# EAGLE design untitled (EAGLE 7.5.0)
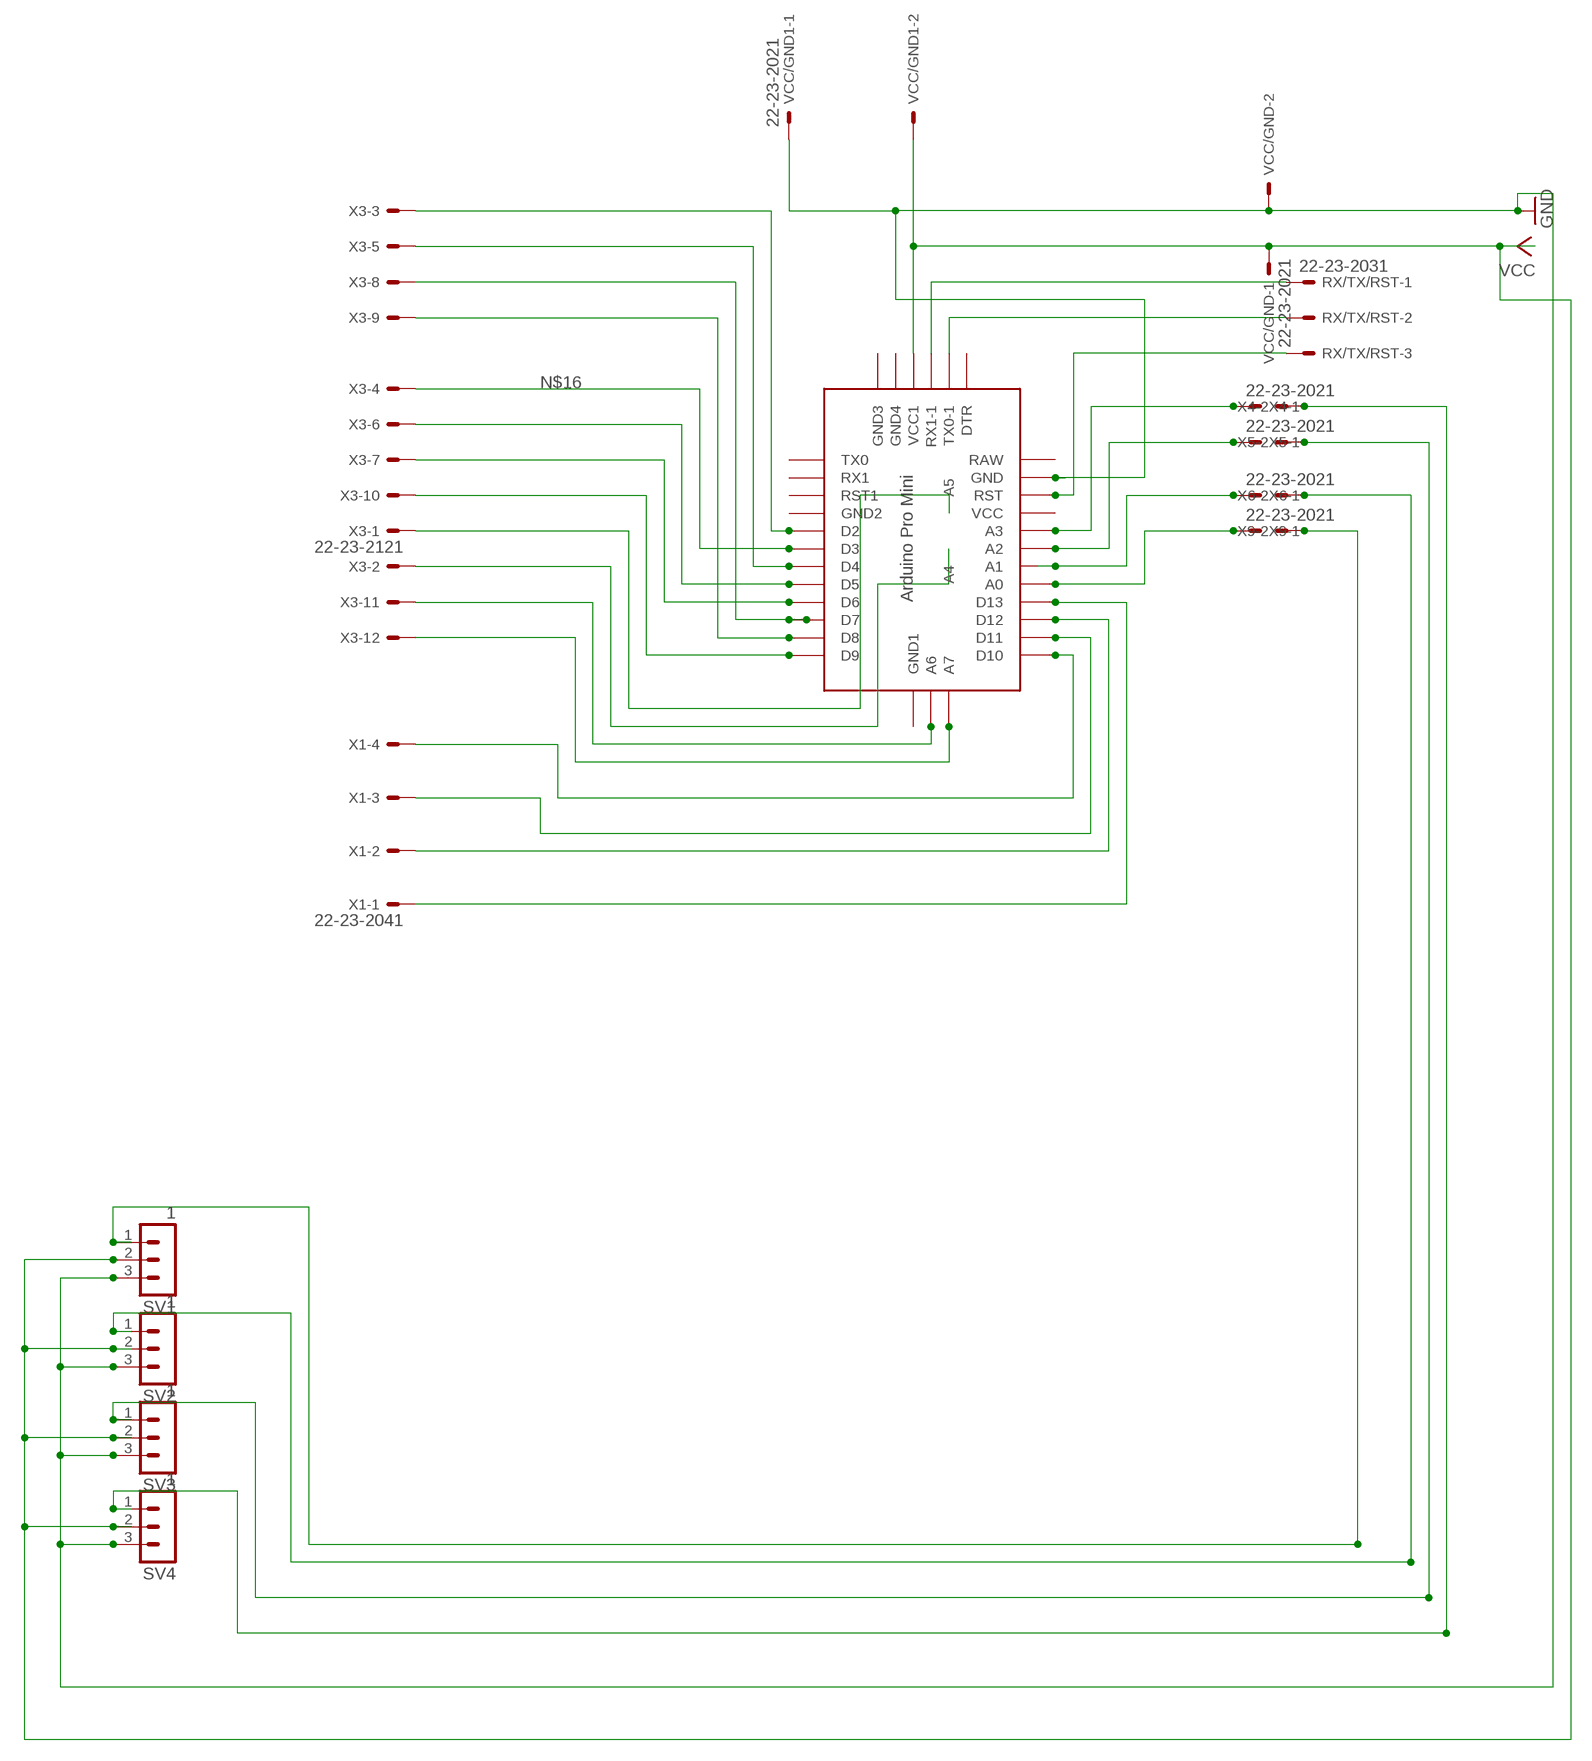
[diagram p0: schematic, sheet 1]

## Parts
RX/TX/RST  22-23-2031  [22-23-2031]
SV1  1  MA03-1  [MA03-1]
SV2  1  MA03-1  [MA03-1]
SV3  1  MA03-1  [MA03-1]
SV4  1  MA03-1  [MA03-1]
U$1  ABK-PRO-MINI  [ABK-PRO-MINI]
VCC/GND  22-23-2021  [22-23-2021]
VCC/GND1  22-23-2021  [22-23-2021]
X1  22-23-2041  [22-23-2041]
X3  22-23-2121  [22-23-2121]
X4  22-23-2021  [22-23-2021]
X5  22-23-2021  [22-23-2021]
X6  22-23-2021  [22-23-2021]
X9  22-23-2021  [22-23-2021]

## Nets
GND: SV1.3 SV2.3 SV3.3 SV4.3 U$1.GND VCC/GND1.1 VCC/GND.2
N$1: RX/TX/RST.2 U$1.TX0-1
N$2: U$1.A3 X4.1
N$3: U$1.D10 X1.4
N$4: U$1.A2 X5.1
N$5: RX/TX/RST.3 U$1.RST
N$6: SV4.1 X4.2
N$7: SV3.1 X5.2
N$8: SV2.1 X6.2
N$9: SV1.1 X9.2
N$10: U$1.D4 X3.5
N$11: U$1.D7 X3.8
N$12: U$1.D8 X3.9
N$13: U$1.D2 X3.3
N$14: U$1.D3 X3.4
N$15: U$1.D5 X3.6
N$16: U$1.D6 X3.7
N$17: U$1.D9 X3.10
N$18: U$1.A5 X3.1
N$19: U$1.A4 X3.2
N$20: U$1.A6 X3.11
N$21: U$1.A7 X3.12
N$22: U$1.A1 X6.1
N$23: RX/TX/RST.1 U$1.RX1-1
N$24: U$1.D11 X1.3
N$25: U$1.D12 X1.2
N$26: U$1.D13 X1.1
N$32: U$1.A0 X9.1
VCC: SV1.2 SV2.2 SV3.2 SV4.2 U$1.VCC1 VCC/GND1.2 VCC/GND.1
Unconnected: U$1.DTR U$1.GND1(GND2) U$1.GND2(GND3) U$1.GND3(GND4) U$1.GND4(GND1) U$1.RAW U$1.RST1 U$1.RX1 U$1.TX0 U$1.VCC

## Library data of the parts
RX/TX/RST = con-molex:22-23-2031: .100" (2.54mm) Center Header - 3 Pin; MF: MOLEX; MPN: 22-23-2031; OC_FARNELL: 1462950; OC_NEWARK: 30C0862
SV1-SV4 = con-lstb:MA03-1: PIN HEADER; OC_FARNELL: unknown; OC_NEWARK: unknown
U$1 = Arduino-clone:ABK-PRO-MINI: ABK Pro-Mini Arduino Clone
VCC/GND VCC/GND1 X4-X6 X9 = con-molex:22-23-2021: .100" (2.54mm) Center Header - 2 Pin; MF: MOLEX; MPN: 22-23-2021; OC_FARNELL: 1462926; OC_NEWARK: 25C3832
X1 = con-molex:22-23-2041: .100" (2.54mm) Center Header - 4 Pin; MF: MOLEX; MPN: 22-23-2041; OC_FARNELL: 1462920; OC_NEWARK: 38C0355
X3 = con-molex:22-23-2121: .100" (2.54mm) Center Header - 12 Pin; MF: MOLEX; MPN: 22-23-2121; OC_FARNELL: 1462935; OC_NEWARK: 56H0456

## Board
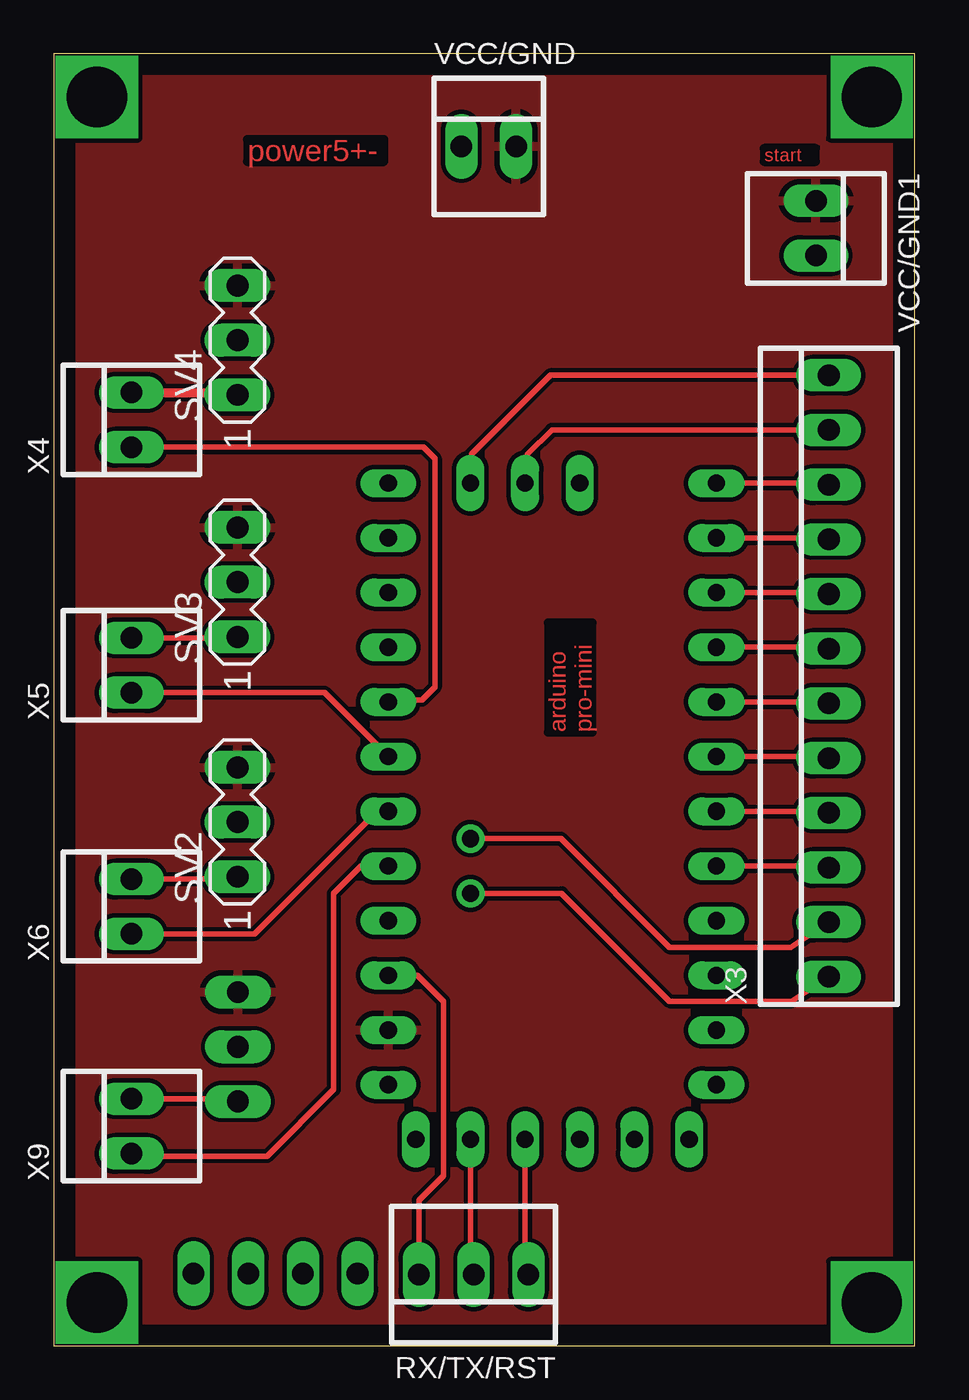
[diagram p1: board, top side]
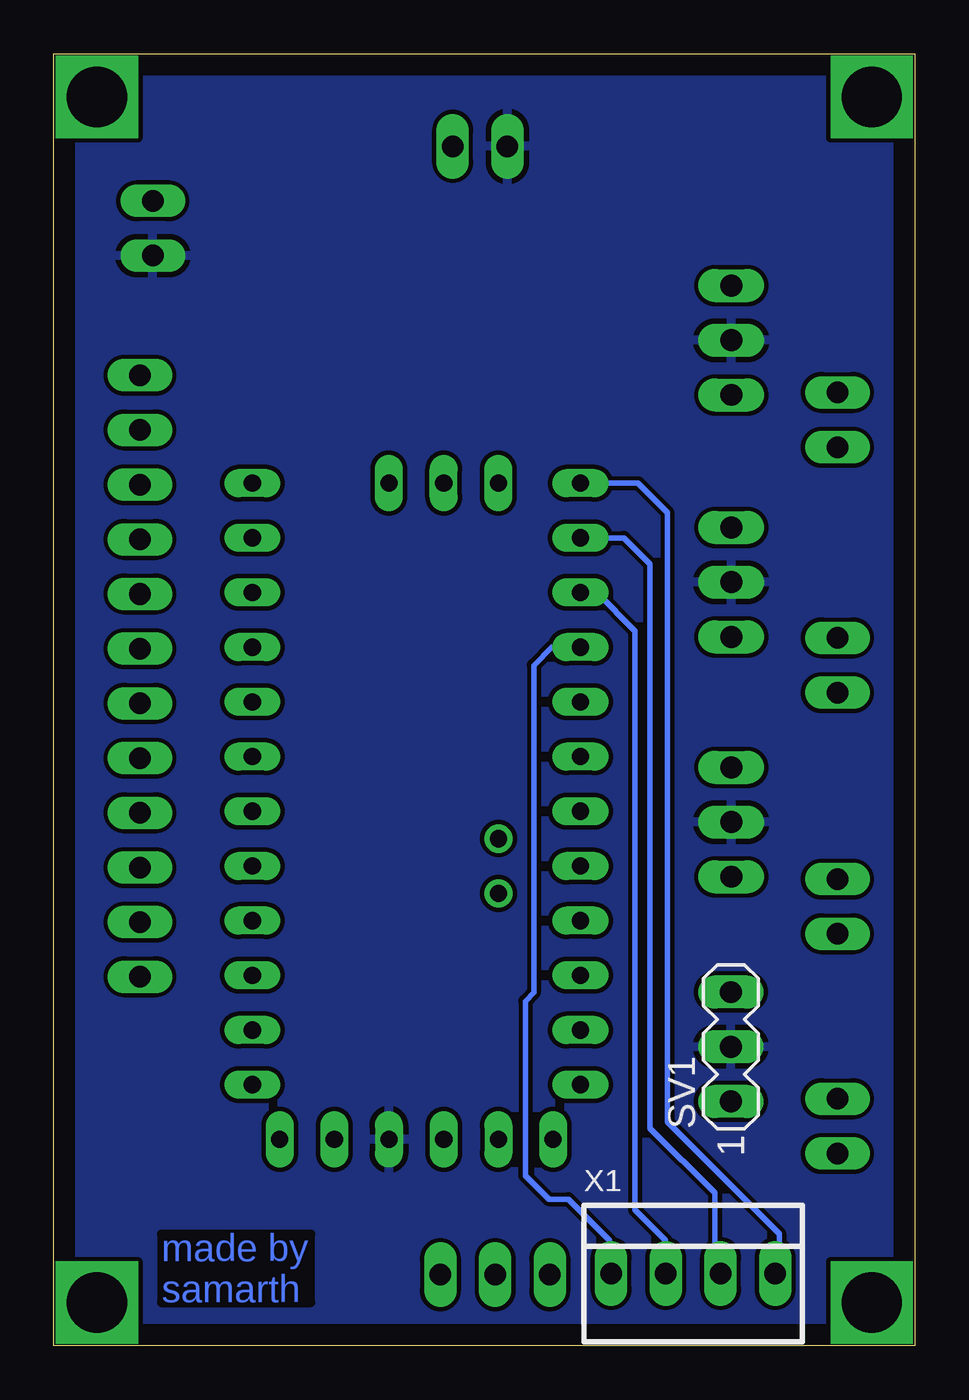
[diagram p2: board, bottom side, seen from below]

Size 40 x 60 mm. Coordinates in mm from the lower left corner, seen from the top.
Outline: 0,0 40,0 40,60 0,60 0,0
Copper layers (1*16): Top 0.035mm / dielectric 1.53mm / Bottom 0.035mm
Design rules "default *": minimum track width 1mil, minimum drill 4mil, track to track 8mil, track to pad 8mil, pad to pad 8mil, via to via 8mil, smd to smd 8mil, copper to edge 1mm, drill to drill 2mil, minimum pad ring 10mil, minimum via ring 8mil, stop-mask expansion 4mil, vias tented up to drill 0mil, thermal gap 10mil

### Footprints (pad centres in the part's own frame; a part is rotated, then mirrored left to right if it is on the bottom)
22-23-2031 = drill 1 long: 1 -2.54,0; 2 0,0; 3 2.54,0
MA03-1 = drill 1.016 long: 1 -2.54,0; 2 0,0; 3 2.54,0
ABK-PRO-MINI = drill 0.8 long: A0 10.16,-3.81; A1 10.16,-6.35; A2 10.16,-8.89; A3 10.16,-11.43; A6 3.81,-21.59; A7 6.35,-21.59; D2 -5.08,-3.81; D3 -5.08,-6.35; D4 -5.08,-8.89; D5 -5.08,-11.43; D6 -5.08,-13.97; D7 -5.08,-16.51; D8 -5.08,-19.05; D9 -5.08,-21.59; D10 10.16,-21.59; D11 10.16,-19.05; D12 10.16,-16.51; D13 10.16,-13.97; DTR 8.89,8.89; GND 10.16,3.81; GND1 -5.08,-1.27; GND2 -3.81,8.89; GND3 -1.27,8.89; GND4 1.27,-21.59; RAW 10.16,6.35; RST 10.16,1.27; RST1 -5.08,1.27; RX1 -5.08,3.81; RX1-1 3.81,8.89; TX0 -5.08,6.35; TX0-1 6.35,8.89; VCC 10.16,-1.27; VCC1 1.27,8.89 | drill 0.8: A4 6.35,-5.08; A5 6.35,-2.54
22-23-2021 = drill 1 long: 1 -1.27,0; 2 1.27,0
22-23-2041 = drill 1 long: 1 -3.81,0; 2 -1.27,0; 3 1.27,0; 4 3.81,0
22-23-2121 = drill 1 long: 1 -13.97,0; 2 -11.43,0; 3 -8.89,0; 4 -6.35,0; 5 -3.81,0; 6 -1.27,0; 7 1.27,0; 8 3.81,0; 9 6.35,0; 10 8.89,0; 11 11.43,0; 12 13.97,0

### Placement (x,y rotation side)
RX/TX/RST  19.5,3.3 180 top
SV1  8.55,13.88 90 bottom
SV2  8.53,24.32 90 top
SV3  8.53,35.46 90 top
SV4  8.53,46.7 90 top
U$1  25.7,18.47 180 top
VCC/GND  20.2,55.7 0 top
VCC/GND1  35.4,51.9 270 top
X1  10.3,3.35 0 bottom
X3  36,31.1 90 top
X4  3.6,43 90 top
X5  3.6,31.6 90 top
X6  3.6,20.4 90 top
X9  3.6,10.2 90 top

### Tracks (layer width: path | path; a pad name or v marks a point on that pad's centre or on a via)
GND
  pour Top: 0,60 40,60 40,0 0,0
N$1
  Top 0.254: U$1.TX0-1 19.35,3.45 RX/TX/RST.2
N$2
  Top 0.254: X4.1 17.17,41.73 17.7,41.2 17.7,30.6 17.1,30 15.64,30 U$1.A3
N$3
  Bottom 0.254: X1.4 6.3,3.54 6.3,5.2 11.5,10.4 11.5,38.7 12.86,40.06 U$1.D10
N$4
  Top 0.254: X5.1 12.57,30.33 U$1.A2
N$5
  Top 0.254: RX/TX/RST.3 16.96,6.76 18.1,7.9 18.1,16 16.9,17.2 U$1.RST
N$6
  Top 0.406: X4.2 8.53,44.27 SV4.1
N$7
  Top 0.254: X5.2 8.98,32.87 SV3.1
N$8
  Top 0.254: X6.2 8.92,21.67 SV2.1
N$9
  Top 0.254: X9.2 8.92,11.47 SV1.1
N$10
  Top 0.254: U$1.D4 35.33,27.36 X3.5
N$11
  Top 0.254: U$1.D7 35.33,34.98 X3.8
N$12
  Top 0.254: U$1.D8 35.33,37.52 X3.9
N$13
  Top 0.254: U$1.D2 35.33,22.28 X3.3
N$14
  Top 0.254: U$1.D3 35.33,24.82 X3.4
N$15
  Top 0.254: U$1.D5 35.33,29.9 X3.6
N$16
  Top 0.254: U$1.D6 35.33,32.44 X3.7
N$17
  Top 0.254: U$1.D9 35.33,40.06 X3.10
N$18
  Top 0.254: U$1.A5 23.59,21.01 28.6,16 34.27,16 X3.1
N$19
  Top 0.254: U$1.A4 23.55,23.55 28.6,18.5 34.23,18.5 X3.2
N$20
  Top 0.254: X3.11 23.13,42.53 22,41.4 22,40.17 U$1.A6
N$21
  Top 0.254: X3.12 23.07,45.07 19.4,41.4 19.4,40.11 U$1.A7
N$22
  Top 0.254: X6.1 9.33,19.13 14.9,24.7 15.42,24.7 U$1.A1
N$23
  Top 0.254: U$1.RX1-1 21.89,3.45 RX/TX/RST.1
N$24
  Bottom 0.254: U$1.D11 13.52,37.52 12.3,36.3 12.3,10.1 9.3,7.1 9.3,3.62 X1.3
N$25
  Bottom 0.254: U$1.D12 14.78,34.98 13,33.2 13,6.3 11.6,4.9 11.6,3.38 X1.2
N$26
  Bottom 0.254: U$1.D13 16.86,32.44 17.7,31.6 17.7,16.4 18.1,16 18.1,7.9 17,6.8 16.1,6.8 14.2,4.9 14.2,3.44 X1.1
N$27  (via drill 2.8)
  other vias: 2,2
N$28  (via drill 2.8)
  other vias: 38,2
N$29  (via drill 2.8)
  other vias: 38,58
N$30  (via drill 2.8)
  other vias: 2,58
N$32
  Top 0.254: U$1.A0 14.28,22.28 13,21 13,11.9 9.9,8.8 3.73,8.8 X9.1
VCC
  pour Bottom: 0,60 40,60 40,0 0,0

### Text on the board
Top: power5+- | start | arduino / pro-mini
Bottom: made by / samarth